# EAGLE schematic mini_optron (EAGLE 9.6.1)
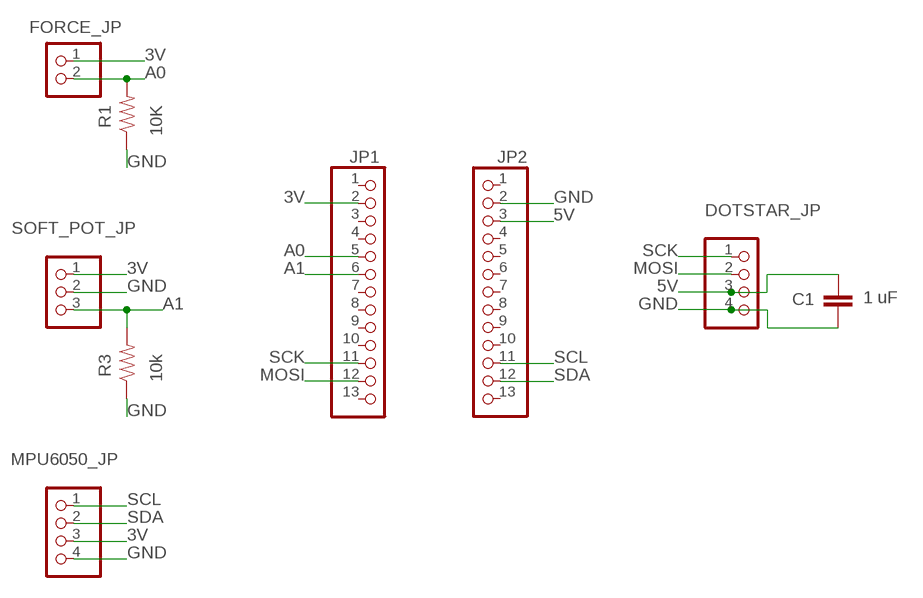
[diagram p0: schematic, sheet 1]

## Parts
C1  1 uF  C5/7.2  [C5B7.2]
DOTSTAR_JP  PINHD-1X4  [1X04]
FORCE_JP  PINHD-1X2  [1X02]
JP1  PINHD-1X13_BIG  [1X13-BIG]
JP2  PINHD-1X13_BIG  [1X13-BIG]
MPU6050_JP  PINHD-1X4  [1X04]
R1  10K  RESISTORAXIAL-0.3  [AXIAL-0.3]
R3  10k  RESISTORAXIAL-0.3  [AXIAL-0.3]
SOFT_POT_JP  PINHD-1X3  [1X03]

## Nets
3V: FORCE_JP.1 JP1.2 MPU6050_JP.3 SOFT_POT_JP.1
5V: C1.1 DOTSTAR_JP.3 JP2.3
A0: FORCE_JP.2 JP1.5 R1.P$2
A1: JP1.6 R3.P$2 SOFT_POT_JP.3
GND: C1.2 DOTSTAR_JP.4 JP2.2 MPU6050_JP.4 R1.P$1 R3.P$1 SOFT_POT_JP.2
MOSI: DOTSTAR_JP.2 JP1.12
SCK: DOTSTAR_JP.1 JP1.11
SCL: JP2.11 MPU6050_JP.1
SDA: JP2.12 MPU6050_JP.2
Unconnected: JP1.1 JP1.3 JP1.4 JP1.7 JP1.8 JP1.9 JP1.10 JP1.13 JP2.1 JP2.4 JP2.5 JP2.6 JP2.7 JP2.8 JP2.9 JP2.10 JP2.13

## Library data of the parts
C1 = capacitor-wima:C: CAPACITOR naming: grid - package width; MF: AVX; MPN: 0805YD105KAT2A; OC_NEWARK: 95W9236
DOTSTAR_JP MPU6050_JP = pinhead:PINHD-1X4: PIN HEADER
FORCE_JP = pinhead:PINHD-1X2: PIN HEADER
JP1 JP2 = adafruit:PINHD-1X13: PIN HEADER; OC_NEWARK: unknown
R1 R3 = SparkFun-Resistors:RESISTOR: Generic Resistor Package; MF: VISHAY; MPN: CRCW060310K0FKEA; OC_NEWARK: 52K8063
SOFT_POT_JP = pinhead:PINHD-1X3: PIN HEADER

## Net classes
0 default: width 0.305 mm, drill 0.508 mm, clearance 0.254 mm